# EAGLE design TeamDIGIT_Wired_PCB_QFN_V4 (EAGLE 9.6.2)
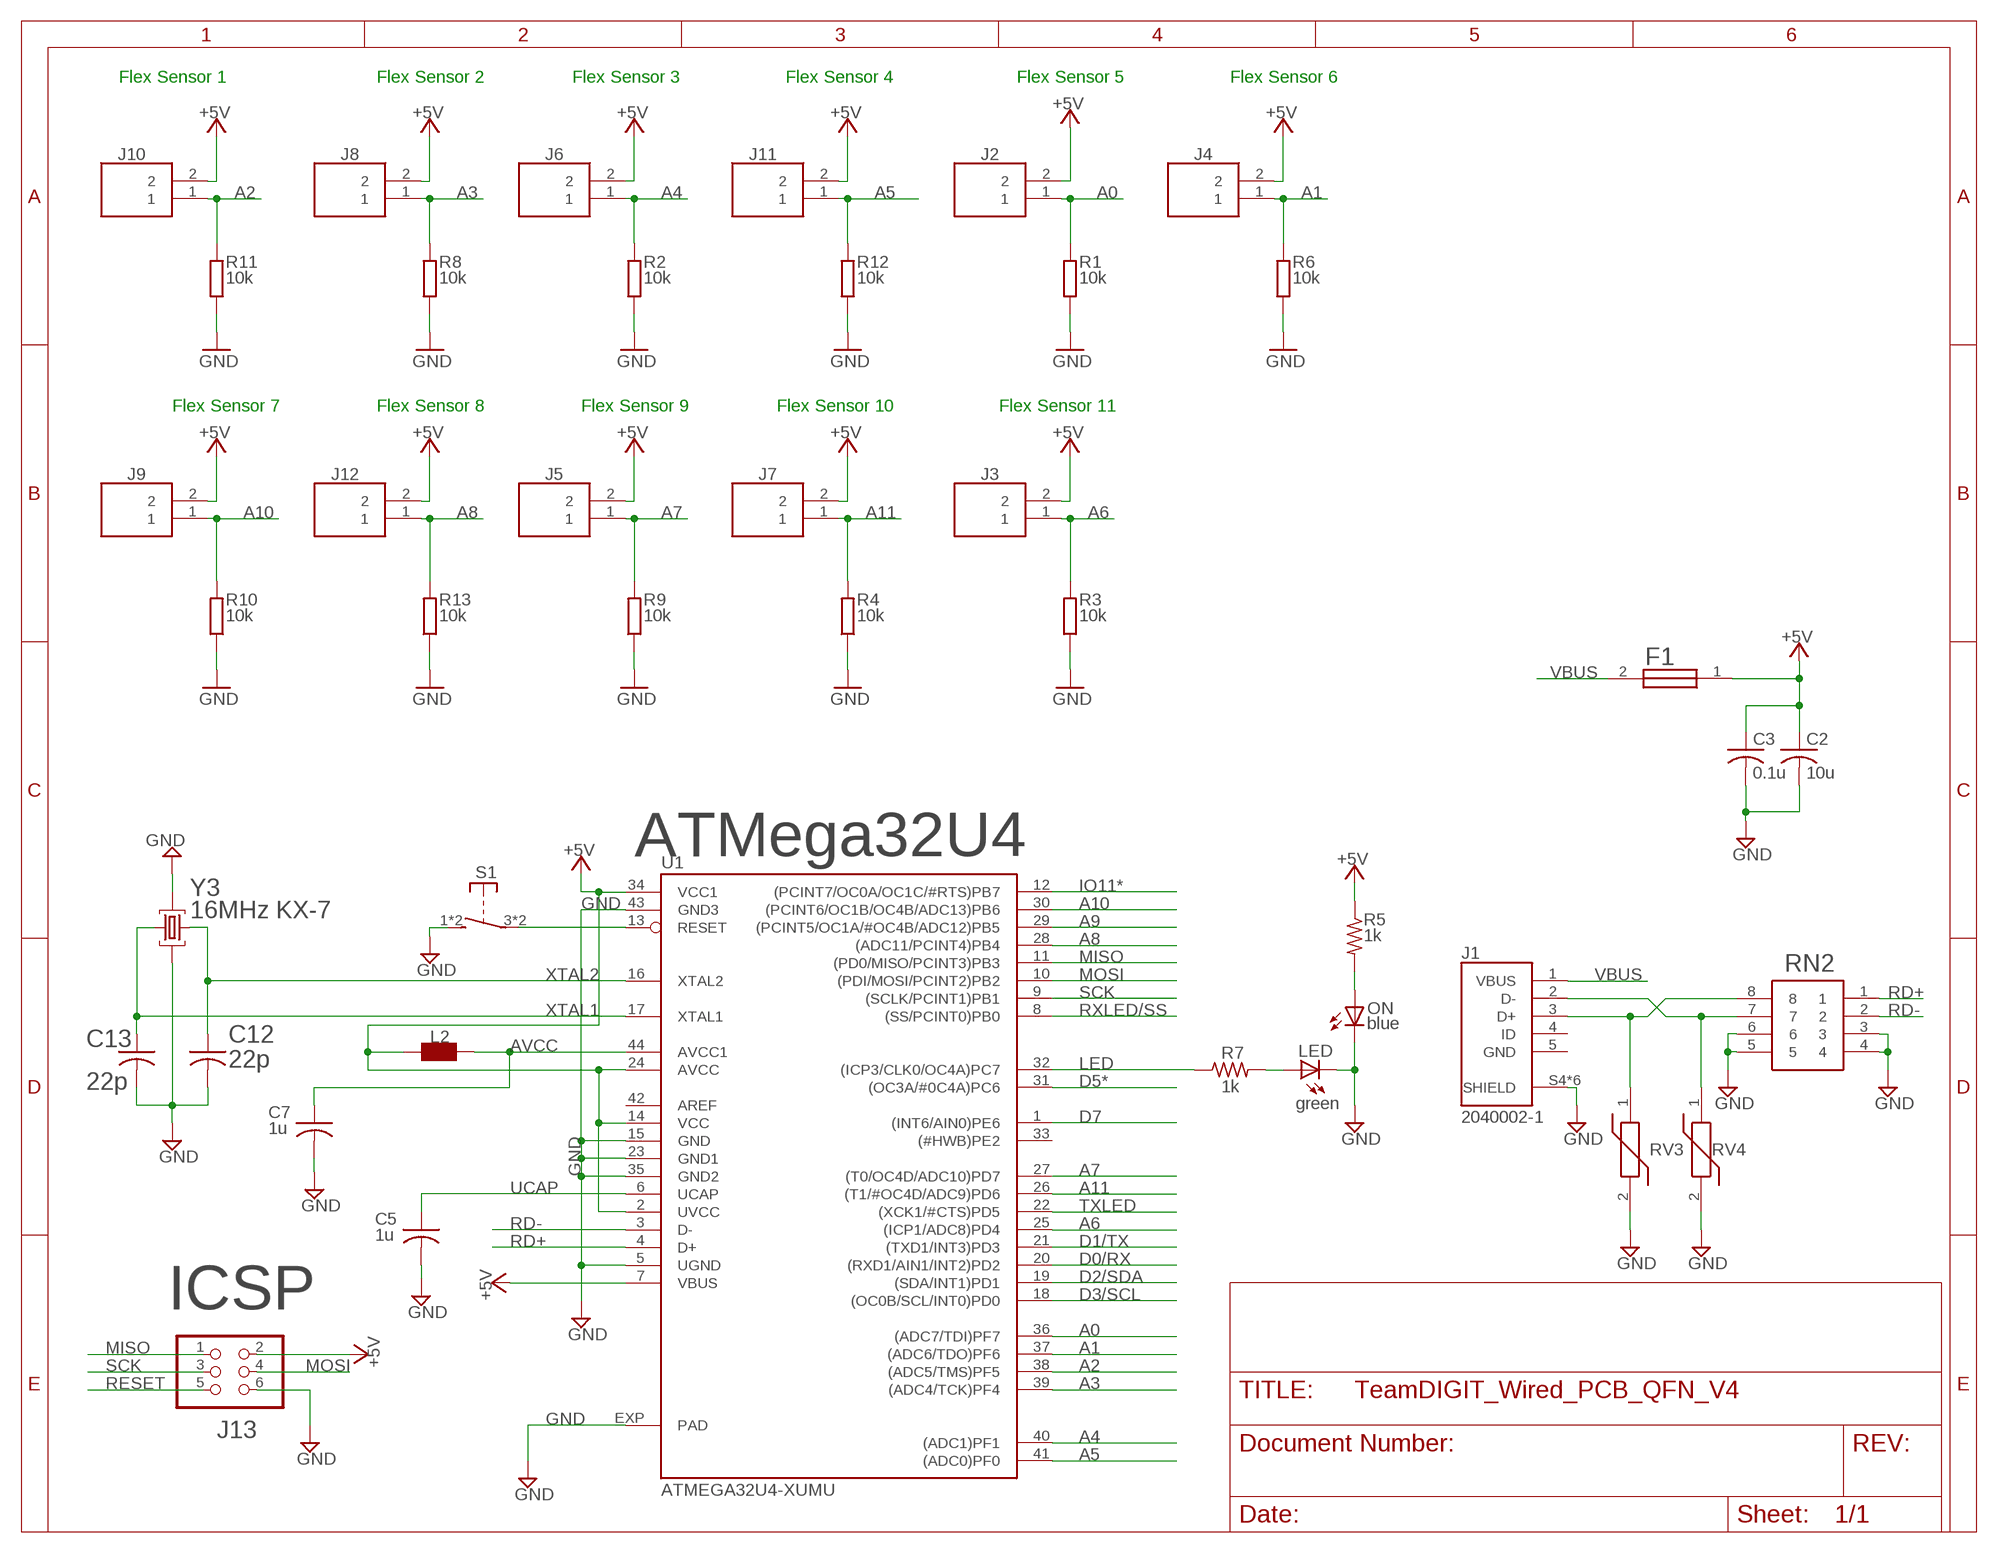
[diagram p0: schematic, sheet 1]

## Parts
C2  10u  C-USC0603  [C0603]
C3  0.1u  C-USC0603  [C0603]
C5  1u  C-USC0603  [C0603]
C7  1u  C-USC0603  [C0603]
C12  22p  C-USC0603  [C0603]
C13  22p  C-USC0603  [C0603]
F1  MF-MSMF050-2  [FUSC4632X85N]
J1  2040002-1  [TE_2040002-1]
J2  6-440054-2  [RHDR2W97P0X254_1X2_654X508X137]
J3  6-440054-2  [RHDR2W97P0X254_1X2_654X508X137]
J4  6-440054-2  [RHDR2W97P0X254_1X2_654X508X137]
J5  6-440054-2  [RHDR2W97P0X254_1X2_654X508X137]
J6  6-440054-2  [RHDR2W97P0X254_1X2_654X508X137]
J7  6-440054-2  [RHDR2W97P0X254_1X2_654X508X137]
J8  6-440054-2  [RHDR2W97P0X254_1X2_654X508X137]
J9  6-440054-2  [RHDR2W97P0X254_1X2_654X508X137]
J10  6-440054-2  [RHDR2W97P0X254_1X2_654X508X137]
J11  6-440054-2  [RHDR2W97P0X254_1X2_654X508X137]
J12  6-440054-2  [RHDR2W97P0X254_1X2_654X508X137]
J13  3x2M  PINHD-2X3  [2X03]
L2  MH2029-300Y  WE-CBF_0805  [0805]
LED  green  LEDCHIPLED_0805  [CHIPLED_0805]
ON  blue  LEDCHIPLED_0805  [CHIPLED_0805]
R1  10k  R-EU_R0603  [R0603]
R2  10k  R-EU_R0603  [R0603]
R3  10k  R-EU_R0603  [R0603]
R4  10k  R-EU_R0603  [R0603]
R5  1k  R-US_R0603  [R0603]
R6  10k  R-EU_R0603  [R0603]
R7  1k  R-US_R0603  [R0603]
R8  10k  R-EU_R0603  [R0603]
R9  10k  R-EU_R0603  [R0603]
R10  10k  R-EU_R0603  [R0603]
R11  10k  R-EU_R0603  [R0603]
R12  10k  R-EU_R0603  [R0603]
R13  10k  R-EU_R0603  [R0603]
RN2  CAY16-220J4LF  [CAY1647R0F4LF]
RV3  CG0603MLC-05E  [VARC1608X55N]
RV4  CG0603MLC-05E  [VARC1608X55N]
S1  434123025826  [434123025826]
U1  ATMEGA32U4-XUMU  [QFN44ML7X7]
Y3  16MHz KX-7  CRYSTAL-3.2-2.5  [CRYSTAL-3.2-2.5]

## Nets
+5V [5V]: C2.1 C3.1 F1.1 J2.2 J3.2 J4.2 J5.2 J6.2 J7.2 J8.2 J9.2 J10.2 J11.2 J12.2 J13.2 L2.1 R5.1 U1.2(UVCC) U1.7(VBUS) U1.14(VCC) U1.24(AVCC) U1.34(VCC1)
A0: J2.1 R1.2 U1.36((ADC7/TDI)PF7)
A1: J4.1 R6.2 U1.37((ADC6/TDO)PF6)
A2: J10.1 R11.2 U1.38((ADC5/TMS)PF5)
A3: J8.1 R8.2 U1.39((ADC4/TCK)PF4)
A4: J6.1 R2.2 U1.40((ADC1)PF1)
A5: J11.1 R12.2 U1.41((ADC0)PF0)
A6: J3.1 R3.2 U1.25((ICP1/ADC8)PD4)
A7: J5.1 R9.2 U1.27((T0/OC4D/ADC10)PD7)
A8: J12.1 R13.2 U1.28((ADC11/PCINT4)PB4)
A9: U1.29((PCINT5/OC1A/#OC4B/ADC12)PB5)
A10: J9.1 R10.2 U1.30((PCINT6/OC1B/OC4B/ADC13)PB6)
A11: J7.1 R4.2 U1.26((T1/#OC4D/ADC9)PD6)
AVCC: C7.1 L2.2 U1.44(AVCC1)
D0/RX: U1.20((RXD1/AIN1/INT2)PD2)
D1/TX: U1.21((TXD1/INT3)PD3)
D2/SDA: U1.19((SDA/INT1)PD1)
D3/SCL: U1.18((OC0B/SCL/INT0)PD0)
D5*: U1.31((OC3A/#0C4A)PC6)
D7: U1.1((INT6/AIN0)PE6)
D+: J1.3(D+) RN2.8 RV3.1
D-: J1.2(D-) RN2.7 RV4.1
GND [gnd]: C2.2 C3.2 C5.2 C7.2 C12.2 C13.2 J1.S4(SHIELD) J1.S5(SHIELD) J1.SH1(SHIELD) J1.SH2(SHIELD) J1.SH3(SHIELD) J1.SH4(SHIELD) J13.6 LED.C ON.C R1.1 R2.1 R3.1 R4.1 R6.1 R8.1 R9.1 R10.1 R11.1 R12.1 R13.1 RN2.3 RN2.4 RN2.5 RN2.6 RV3.2 RV4.2 S1.1(S) S1.2(S) U1.5(UGND) U1.15(GND) U1.23(GND1) U1.35(GND2) U1.43(GND3) U1.EXP(PAD) Y3.2(GND) Y3.4(GND)
IO11*: U1.12((PCINT7/OC0A/OC1C/#RTS)PB7)
LED: R7.1 U1.32((ICP3/CLK0/OC4A)PC7)
MISO: J13.1 U1.11((PD0/MISO/PCINT3)PB3)
MOSI: J13.4 U1.10((PDI/MOSI/PCINT2)PB2)
N$3: ON.A R5.2
N$7: LED.A R7.2
RD+: RN2.1 U1.4(D+)
RD-: RN2.2 U1.3(D-)
RESET: J13.5 S1.3(P) S1.4(P) U1.13(RESET)
RXLED/SS: U1.8((SS/PCINT0)PB0)
SCK: J13.3 U1.9((SCLK/PCINT1)PB1)
TXLED: U1.22((XCK1/#CTS)PD5)
UCAP: C5.1 U1.6(UCAP)
VBUS: F1.2 J1.1(VBUS)
XTAL1: C13.1 U1.17(XTAL1) Y3.1(C1)
XTAL2: C12.1 U1.16(XTAL2) Y3.3(C2)
Unconnected: J1.4(ID) U1.33((#HWB)PE2)

## Notes on the sheet
- Flex Sensor 1 | Flex Sensor 2 | Flex Sensor 3 | Flex Sensor 4 | Flex Sensor 5 | Flex Sensor 6
- Flex Sensor 7 | Flex Sensor 8 | Flex Sensor 9 | Flex Sensor 10 | Flex Sensor 11
- ATMega32U4
- ICSP

## Power pins joined to a net without a drawn wire
AREF: U1.42(AREF)
GND: J1.5(GND)

## Library data of the parts
C2 C3 C5 C7 C12 C13 = rcl:C-US: CAPACITOR, American symbol; SPICEPREFIX: C
F1 = SamacSys_Parts:MF-MSMF050-2: Fuse, PTC, Resettable, SMD, 1812, 500mA Bourns 0.5A Surface Mount Resettable Fuse, 15 V Source: Datasheet <https://www.bourns.com/pdfs/mfmsmf.pdf>; DESCRIPTION: Fuse, PTC, Resettable, SMD, 1812, 500mA Bourns 0.5A Surface Mount Resettable Fuse, 15 V; HEIGHT: 0.85mm; MANUFACTURER_NAME: Bourns; MANUFACTURER_PART_NUMBER: MF-MSMF050-2; MOUSER_PART_NUMBER: 652-MF-MSMF050-2; MOUSER_PRICE-STOCK: https://www.mouser.co.uk/ProductDetail/Bourns/MF-MSMF050-2?qs=t3shhpq1i1DZ7OBD5kLNoA%3D%3D
J1 = 2040002-1:2040002-1: Conn USB Type B RCP 5 POS 0.65mm Solder RA SMD 5 Terminal 1 Port T/R; CENTERLINE_PITCH: .65 mm[.025 in]; COMMENT: 2040002-1; DESCRIPTION: Conn Micro USB 2.0 Type B RCP 5 POS 0.65mm Solder RA SMD 5 Terminal 1 Port T/R; DIGI-KEY_PART_NUMBER: A108263TR-ND; MF: TE Connectivity; MP: 2040002-1; NUMBER_OF_POSITIONS: 5; PACKAGE: None; PRODUCT_TYPE: Connector; PURCHASE-URL: https://pricing.snapeda.com/search/part/2040002-1/?ref=eda
J2-J12 = SamacSys_Parts:6-440054-2: HPI 2.0MM,HDR,2POSVERTICAL,BLK Source: Datasheet <https://www.te.com/commerce/DocumentDelivery/DDEController?Action=srchrtrv&DocNm=1-1773713-2_HPI_QRG_EN&DocType=Data Sheet&DocLang=English&PartCntxt=6-440054-2&DocFormat=pdf>; DESCRIPTION: HPI 2.0MM,HDR,2POSVERTICAL,BLK; HEIGHT: 13.79mm; MANUFACTURER_NAME: TE Connectivity; MANUFACTURER_PART_NUMBER: 6-440054-2; MOUSER_PART_NUMBER: 571-6-440054-2; MOUSER_PRICE-STOCK: https://www.mouser.co.uk/ProductDetail/TE-Connectivity-AMP/6-440054-2?qs=lA4hlRvK5kBpenPnFCArVg%3D%3D
J13 = gen_comp:PINHD-2X3: PIN HEADER
L2 = wuerth-elektronik:WE-CBF: SMD EMI Suppression Ferrite Beads - excellent anti-EMI properties - low DCR - impedances till 3000 ohms - rated current up to 6 A
LED ON = led:LED: LED OSRAM: - CHIPLED LG R971, LG N971, LY N971, LG Q971, LY Q971, LO R971, LY R971 LH N974, LH R974 LS Q976, LO Q976, LY Q976 LO Q996 - Hyper CHIPLED LW Q18S LB Q993, LB Q99A, LB R99A - SideLED LS A670, LO A670, LY A670, LG A670, LP A670 LB A673, LV A673, LT A673, LW A673 LH A674 LY A675 LS A676, LA A676, LO A676, LY A676, LW A676 LS A679, LY A679, LG A679 - Hyper Micro SIDELED® LS Y876, LA Y876, LO Y876, LY Y876 LT Y87S - SmartLED LW L88C, LW L88S LB L89C, LB L89S, LG L890 LS L89K, LO L89K, LY L89K LS L896, LA L896, LO L896, LY L896 - TOPLED LS T670, LO T670, LY T670, LG T670, LP T670 LSG T670, LSP T670, LSY T670, LOP T670, LYG T670 LG T671, LOG T671, LSG T671 LB T673, LV T673, LT T673, LW T673 LH T674 LS T676, LA T676, LO T676, LY T676, LB T676, LH T676, LSB T676, LW T676 LB T67C, LV T67C, LT T67C, LS T67K, LO T67K, LY T67K, LW E67C LS E67B, LA E67B, LO E67B, LY E67B, LB E67C, LV E67C, LT E67C LW T67C LS T679, LY T679, LG T679 LS T770, LO T770, LY T770, LG T770, LP T770 LB T773, LV T773, LT T773, LW T773 LH T774 LS E675, LA E675, LY E675, LS T675 LS T776, LA T776, LO T776, LY T776, LB T776 LHGB T686 LT T68C, LB T68C - Hyper Mini TOPLED® LB M676 - Mini TOPLED Santana® LG M470 LS M47K, LO M47K, LY M47K Source: http://www.osram.convergy.de LUXEON: - LUMILED® LXK2-PW12-R00, LXK2-PW12-S00, LXK2-PW14-U00, LXK2-PW14-V00 LXK2-PM12-R00, LXK2-PM12-S00, LXK2-PM14-U00 LXK2-PE12-Q00, LXK2-PE12-R00, LXK2-PE12-S00, LXK2-PE14-T00, LXK2-PE14-U00 LXK2-PB12-K00, LXK2-PB12-L00, LXK2-PB12-M00, LXK2-PB14-N00, LXK2-PB14-P00, LXK2-PB14-Q00 LXK2-PR12-L00, LXK2-PR12-M00, LXK2-PR14-Q00, LXK2-PR14-R00 LXK2-PD12-Q00, LXK2-PD12-R00, LXK2-PD12-S00 LXK2-PH12-R00, LXK2-PH12-S00 LXK2-PL12-P00, LXK2-PL12-Q00, LXK2-PL12-R00 Source: www.luxeon.com KINGBRIGHT: KA-3528ASYC Source: www.kingbright.com
R1-R4 R6 R8-R13 = rcl:R-EU_: RESISTOR, European symbol; SPICEPREFIX: R
R5 R7 = rcl:R-US_: RESISTOR, American symbol; SPICEPREFIX: R
RN2 = SamacSys_Parts:CAY16-220J4LF: Bourns CAY16 Series 22 +/-5% Isolated SMT Resistor Array, 4 Resistors, 0.25W total 1206 (3216M) package Convex Source: Datasheet <https://www.bourns.com/docs/Product-Datasheets/CATCAY.pdf>; DESCRIPTION: Bourns CAY16 Series 22 +/-5% Isolated SMT Resistor Array, 4 Resistors, 0.25W total 1206 (3216M) package Convex; HEIGHT: 0.6mm; MANUFACTURER_NAME: Bourns; MANUFACTURER_PART_NUMBER: CAY16-220J4LF; MOUSER_PART_NUMBER: 652-CAY16-220J4LF; MOUSER_PRICE-STOCK: https://www.mouser.co.uk/ProductDetail/Bourns/CAY16-220J4LF?qs=GbiU%252BivmtKA3DUxfEznDpA%3D%3D
RV3 RV4 = SamacSys_Parts:CG0603MLC-05E: Varistor, ESD Protector, 5VDC,20V,0603 Bourns MLC Series Power Varistor 0.5pF 20V 0603 Case Source: Datasheet; DESCRIPTION: Varistor, ESD Protector, 5VDC,20V,0603 Bourns MLC Series Power Varistor 0.5pF 20V 0603 Case; HEIGHT: 0.55mm; MANUFACTURER_NAME: Bourns; MANUFACTURER_PART_NUMBER: CG0603MLC-05E; MOUSER_PART_NUMBER: 652-CG0603MLC-05E; MOUSER_PRICE-STOCK: https://www.mouser.co.uk/ProductDetail/Bourns/CG0603MLC-05E?qs=lDok7oSghXVLNKMK69q%252BFQ%3D%3D
S1 = SamacSys_Parts:434123025826: TACT SWITCH 4.2X3.2MM VERTICAL T Source: Datasheet <https://www.we-online.com/catalog/datasheet/434123025826.pdf>; DESCRIPTION: TACT SWITCH 4.2X3.2MM VERTICAL T; HEIGHT: 2.7mm; MANUFACTURER_NAME: Wurth Elektronik; MANUFACTURER_PART_NUMBER: 434123025826; MOUSER_PART_NUMBER: 710-434123025826; MOUSER_PRICE-STOCK: https://www.mouser.co.uk/ProductDetail/Wurth-Elektronik/434123025826?qs=sPbYRqrBIVmyWmz4suwZ4A%3D%3D
U1 = gen_comp:ATMEGA32U4-XU
Y3 = gen_comp:CRYSTAL-3.2-2.5

## Net classes
0 default: width 0.254 mm, drill 0.127 mm
1 5V: width 0.254 mm, drill 0.254 mm
2 gnd: width 0.254 mm
3 usbvcc: width 0.254 mm
4 aref: width 0.305 mm

## Board
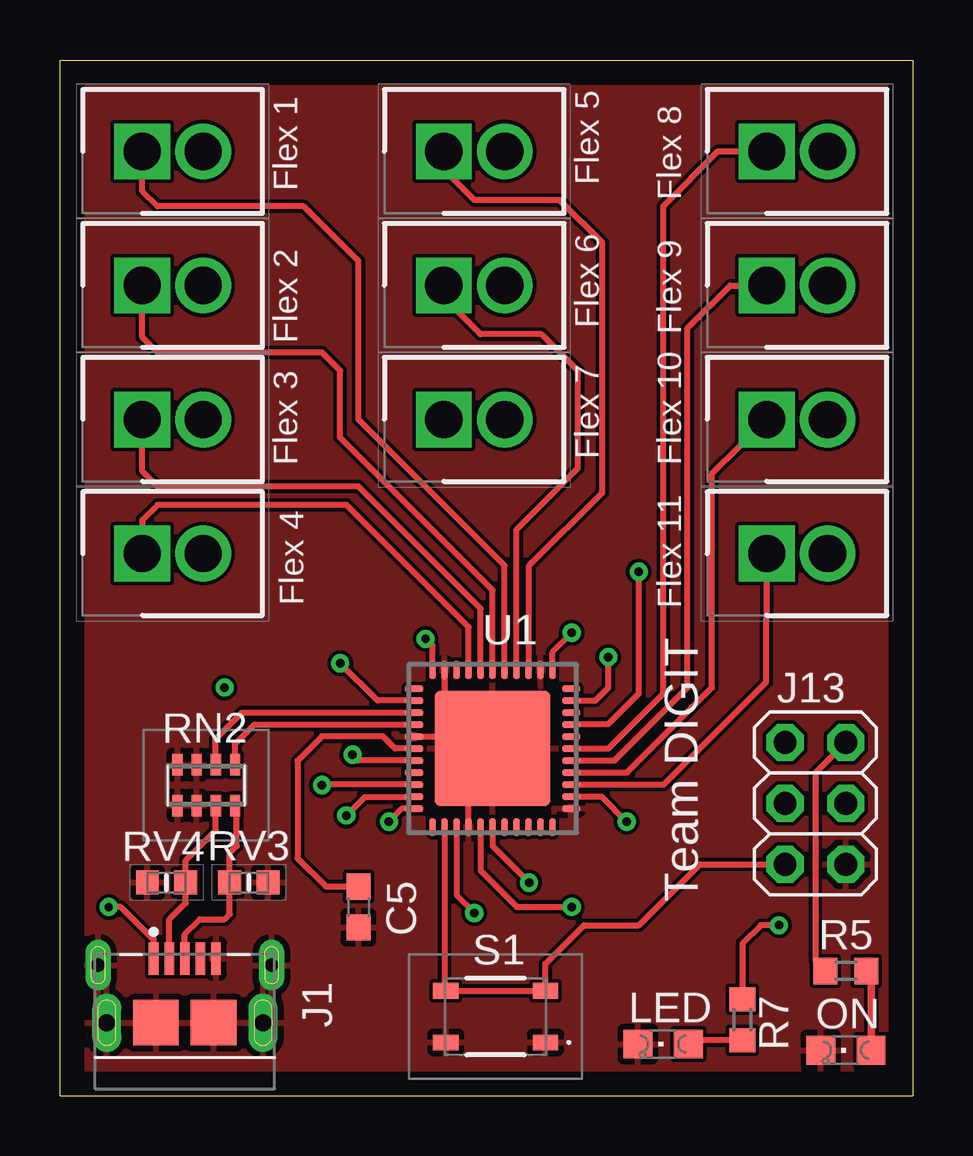
[diagram p1: board, top side]
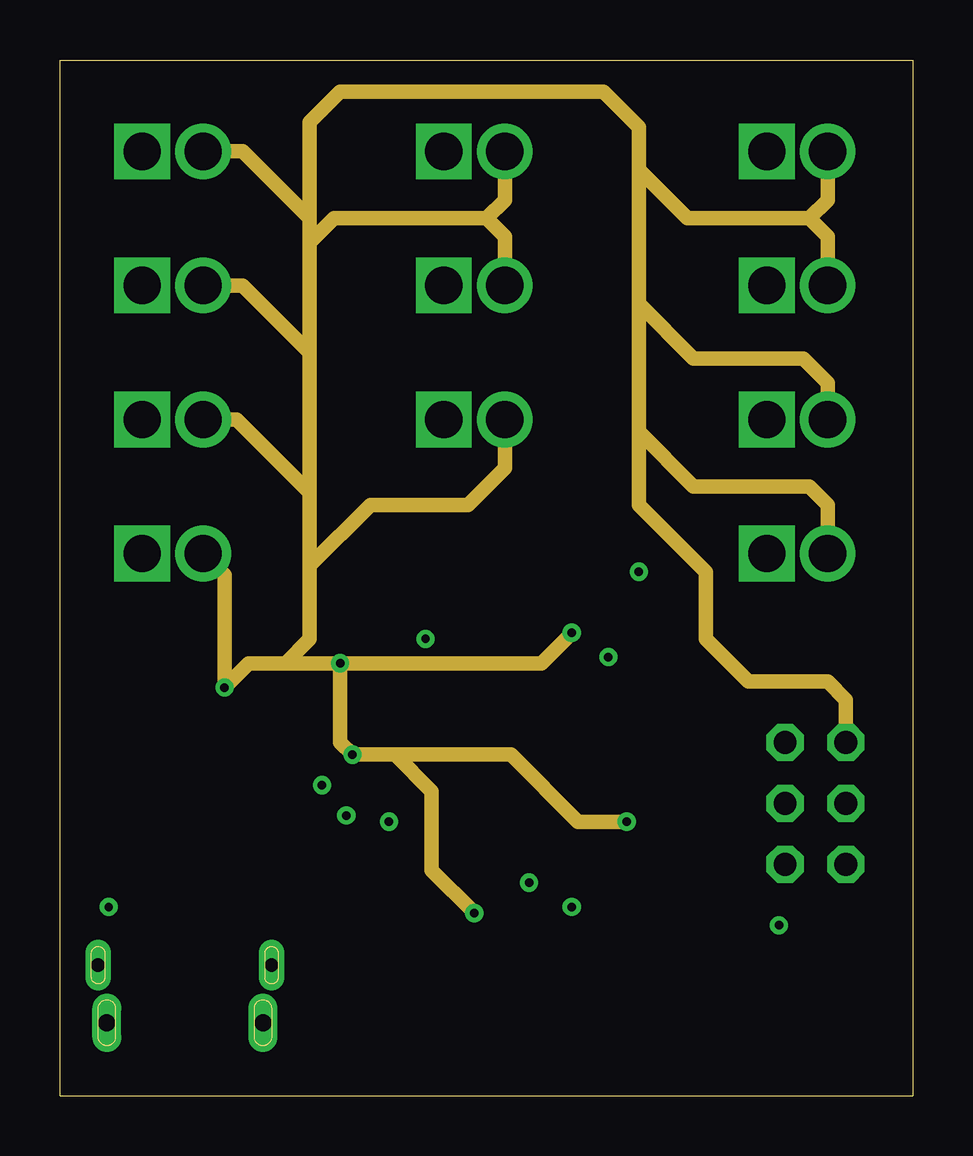
[diagram p2: board, inner layer Route2]
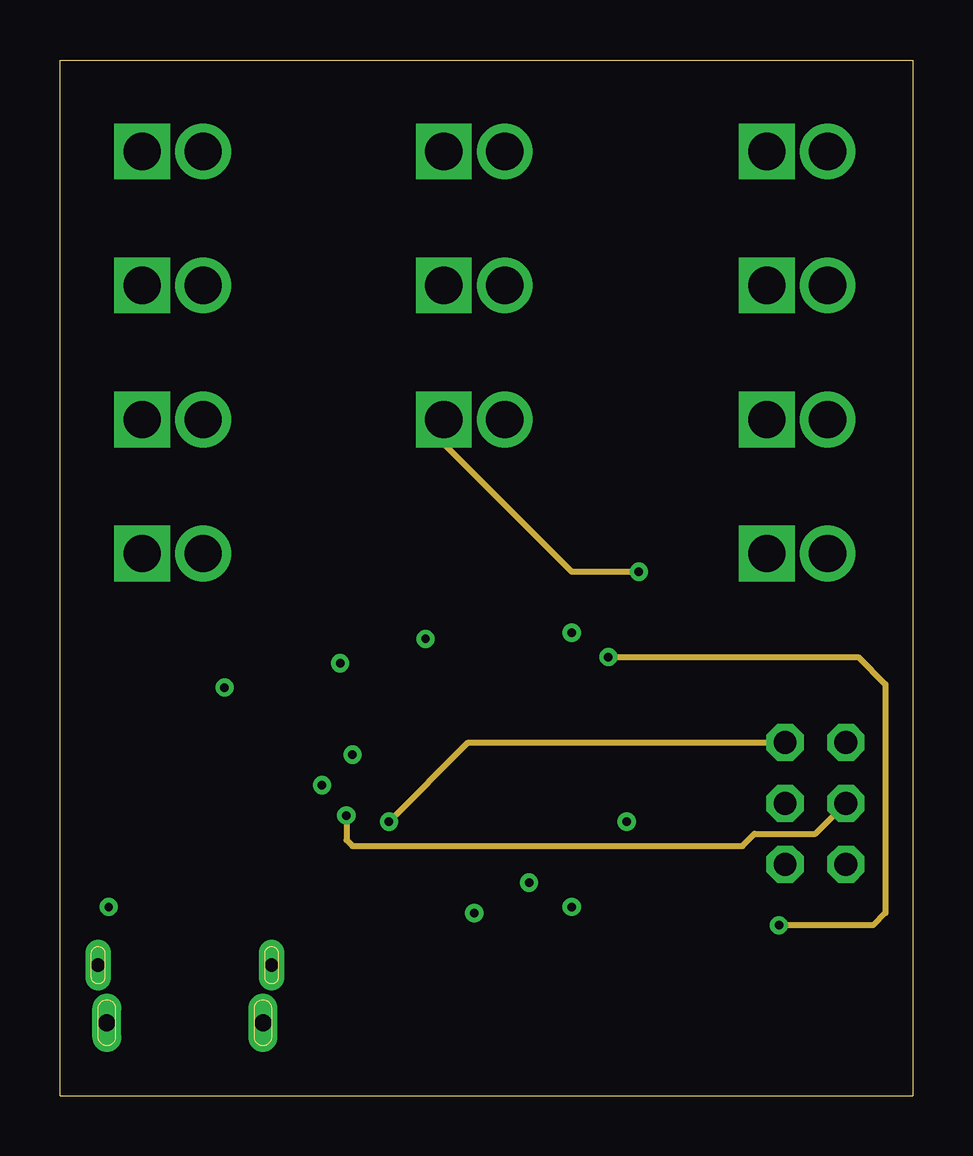
[diagram p3: board, inner layer Route15]
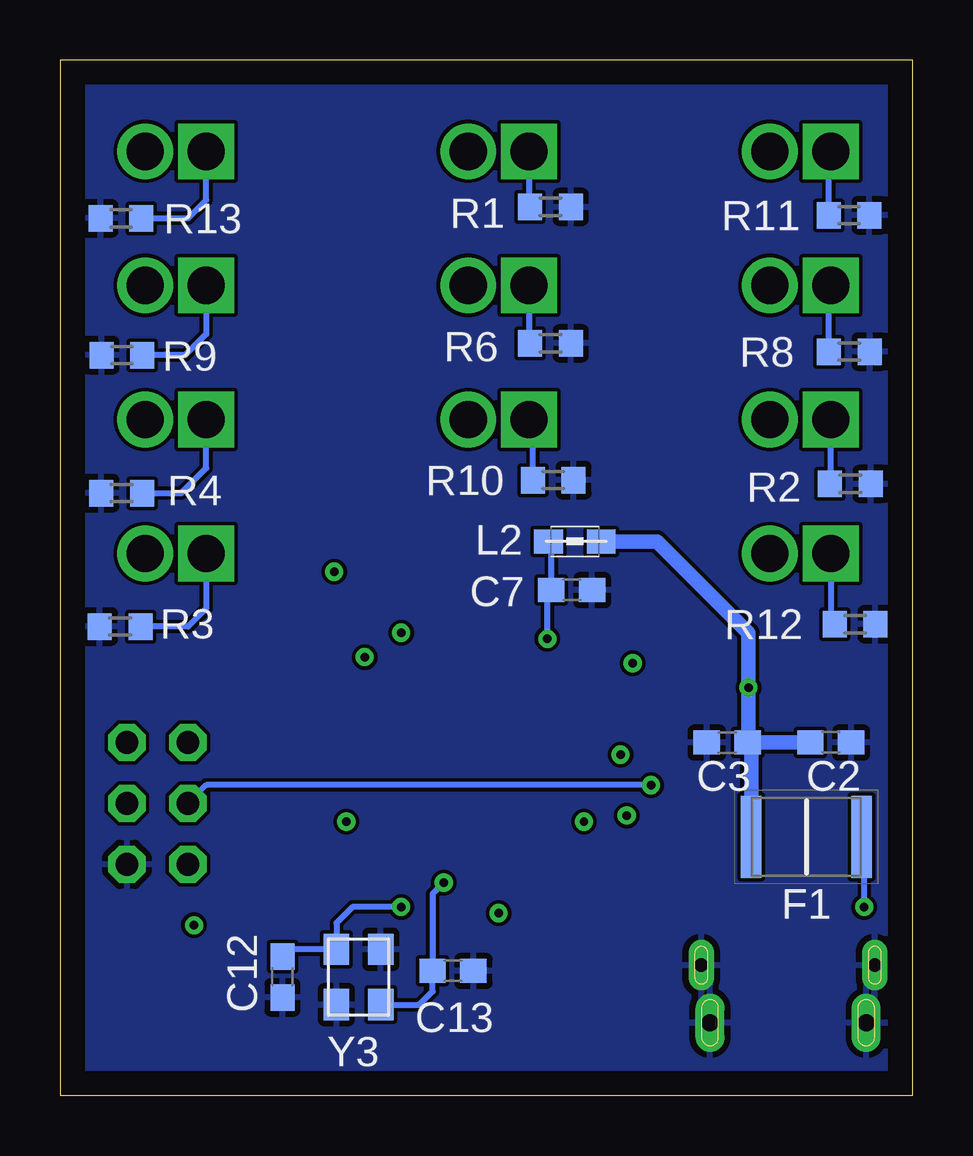
[diagram p4: board, bottom side, seen from below]

Size 35.56 x 43.18 mm. Coordinates in mm from the lower left corner, seen from the top.
Outline: 0,0 0,43.18 35.56,43.18 35.56,0 0,0
Copper layers (1+2*15+16): Top 0.035mm / dielectric 1.5mm / Route2 0.035mm / dielectric 0.15mm / Route15 0.035mm / dielectric 0.2mm / Bottom 0.035mm
Design rules "default *": minimum track width 6mil, minimum drill 0.35mm, track to track 6mil, track to pad 6mil, pad to pad 6mil, via to via 6mil, smd to smd 6mil, copper to edge 40mil, drill to drill 6mil, minimum pad ring 10mil, minimum via ring 8mil, stop-mask expansion 4mil, vias tented up to drill 0mil, thermal gap 10mil

### Footprints (pad centres in the part's own frame; a part is rotated, then mirrored left to right if it is on the bottom)
C0603 = smd 1.1 x 1: 1 -0.85,0; 2 0.85,0
FUSC4632X85N = smd 0.85 x 3.43: 1 -2.3,0; 2 2.3,0
TE_2040002-1 = smd 0.4 x 1.35: 1 -1.3,2.675; 2 -0.65,2.675; 3 0,2.675; 4 0.65,2.675; 5 1.3,2.675 | smd 1.9 x 1.9: S4 -1.2,0; S5 1.2,0 | drill 0.56 long: SH1 -3.615,2.4; SH2 3.615,2.4 | drill 0.71 long: SH3 3.255,0; SH4 -3.255,0
RHDR2W97P0X254_1X2_654X508X137 = drill 1.55 pad 2.325 square: 1 0,0 | drill 1.55 pad 2.325: 2 2.54,0
2X03 = drill 0.95 pad 1.55 octagon: 1 -2.54,-1.27; 2 -2.54,1.27; 3 0,-1.27; 4 0,1.27; 5 2.54,-1.27; 6 2.54,1.27
0805 = smd 1.2 x 1: 1 -1.1,0; 2 1.1,0
CHIPLED_0805 = smd 1.2 x 1.2: A 0,-1.05; C 0,1.05
R0603 = smd 1 x 1.1: 1 -0.85,0; 2 0.85,0
CAY1647R0F4LF = smd 0.425 x 0.9: 1 -1.2,-0.85; 2 -0.4,-0.85; 3 0.4,-0.85; 4 1.2,-0.85; 5 1.2,0.85; 6 0.4,0.85; 7 -0.4,0.85; 8 -1.2,0.85
VARC1608X55N = smd 0.95 x 1: 1 -0.8,0; 2 0.8,0
434123025826 = smd 1.05 x 0.65: 1 -2.075,1.075; 2 2.075,1.075; 3 -2.075,-1.075; 4 2.075,-1.075
QFN44ML7X7 = smd 0.75 x 0.275: 1 -3.275,2.5; 2 -3.275,2; 3 -3.275,1.5; 4 -3.275,1; 5 -3.275,0.5; 6 -3.275,0; 7 -3.275,-0.5; 8 -3.275,-1; 9 -3.275,-1.5; 10 -3.275,-2; 11 -3.275,-2.5; 23 3.275,-2.5; 24 3.275,-2; 25 3.275,-1.5; 26 3.275,-1; 27 3.275,-0.5; 28 3.275,0; 29 3.275,0.5; 30 3.275,1; 31 3.275,1.5; 32 3.275,2; 33 3.275,2.5 | smd 0.275 x 0.75: 12 -2.5,-3.275; 13 -2,-3.275; 14 -1.5,-3.275; 15 -1,-3.275; 16 -0.5,-3.275; 17 0,-3.275; 18 0.5,-3.275; 19 1,-3.275; 20 1.5,-3.275; 21 2,-3.275; 22 2.5,-3.275; 34 2.5,3.275; 35 2,3.275; 36 1.5,3.275; 37 1,3.275; 38 0.5,3.275; 39 0,3.275; 40 -0.5,3.275; 41 -1,3.275; 42 -1.5,3.275; 43 -2,3.275; 44 -2.5,3.275 | smd 4.826 x 4.826: EXP 0,0
CRYSTAL-3.2-2.5 = smd 1.3 x 1.05: 1 -1.15,-0.925; 2 1.15,-0.925; 3 1.15,0.925; 4 -1.15,0.925

### Placement (x,y rotation side)
C2  3.43,14.73 0 bottom
C3  7.75,14.73 180 bottom
C5  12.45,7.87 270 top
C7  14.22,21.08 0 bottom
C12  26.29,4.95 270 bottom
C13  19.18,5.21 0 bottom
F1  4.45,10.79 0 bottom
J1  5.21,3.05 0 top
J2  16,39.37 0 top
J3  29.46,22.61 0 top
J4  16,33.78 0 top
J5  29.46,33.78 0 top
J6  3.43,28.19 0 top
J7  29.46,28.19 0 top
J8  3.43,33.78 0 top
J9  16,28.19 0 top
J10  3.43,39.37 0 top
J11  3.43,22.61 0 top
J12  29.46,39.37 0 top
J13  31.5,12.19 270 top
L2  14.1,23.11 180 bottom
LED  25.15,2.16 90 top
ON  32.77,1.91 90 top
R1  15.11,37.05 180 bottom
R2  2.61,25.51 180 bottom
R3  33.05,19.56 0 bottom
R4  32.99,25.12 0 bottom
R5  32.77,5.21 0 top
R6  15.11,31.37 180 bottom
R7  28.45,3.17 270 top
R8  2.66,31.02 180 bottom
R9  32.98,30.87 0 bottom
R10  15,25.67 180 bottom
R11  2.67,36.7 180 bottom
R12  2.41,19.66 180 bottom
R13  33.02,36.58 0 bottom
RN2  6.1,12.95 180 top
RV3  7.87,8.89 0 top
RV4  4.45,8.89 180 top
S1  18.16,3.3 180 top
U1  18.03,14.48 0 top
Y3  23.11,4.95 90 bottom

### Tracks (layer width: path | path; a pad name or v marks a point on that pad's centre or on a via)
+5V  (via drill 0.35)
  Top 0.254: J13.2 31.5,13.46 31.5,5.63 R5.1 | U1.2 13.24,16.48 v11.68,18.03 | U1.7 12.44,13.98 v12.19,14.22 | U1.14 16.53,8.36 v17.27,7.62 | U1.34 20.53,18.5 v21.34,19.3 | U1.24 22.57,12.48 v23.62,11.43
  Route2 0.61: 9.4,18.03 7.87,18.03 v6.86,17.02 6.86,21.72 J11.2 | 9.4,18.03 10.41,19.05 10.41,22.1 | 24.13,38.61 24.13,40.39 22.66,41.85 11.68,41.85 10.41,40.58 10.41,36.58 | 24.13,38.61 24.13,33.02 | 24.13,33.02 24.13,27.69 | 10.41,22.1 10.41,25.15 | 10.41,30.99 10.41,35.56 | 10.41,35.56 10.41,36.58 | 10.41,30.99 10.41,25.15 | 10.41,25.15 7.37,28.19 J6.2 | 10.41,22.1 12.95,24.64 17.02,24.64 18.54,26.16 J9.2 | 10.41,30.99 7.62,33.78 J8.2 | 24.13,38.61 26.16,36.58 31.24,36.58 | 24.13,33.02 26.42,30.73 30.99,30.73 32,29.72 J7.2 | 24.13,27.69 26.42,25.4 31.24,25.4 32,24.64 J3.2 | J13.2 32.77,16.51 32,17.27 28.7,17.27 26.92,19.05 26.92,21.84 24.13,24.64 24.13,27.69 | v11.68,18.03 9.4,18.03 | v11.68,18.03 11.68,14.73 v12.19,14.22 13.97,14.22 | v17.27,7.62 15.49,9.4 15.49,12.7 13.97,14.22 | v21.34,19.3 20.07,18.03 v11.68,18.03 | v23.62,11.43 21.59,11.43 18.8,14.22 13.97,14.22 | J10.2 7.62,39.37 10.41,36.58 | J2.2 18.54,37.34 17.78,36.58 | 10.41,35.56 11.43,36.58 17.78,36.58 | 17.78,36.58 18.54,35.81 J4.2 | 31.24,36.58 32,35.81 J5.2 | 31.24,36.58 32,37.34 J12.2
  Bottom 0.61: F1.1 6.75,14.58 C3.1 | C3.1 C2.1 | C3.1 6.86,14.77 v6.86,17.02 6.86,19.3 10.67,23.11 L2.1
A0
  Top 0.254: U1.36 19.56,17.78 19.56,22.1 22.61,25.15 22.61,35.56 20.83,37.34 17.27,37.34 16,38.61 J2.1
  Bottom 0.254: J2.1 16,37.1 R1.2
A1
  Top 0.254: U1.37 19.03,23.61 21.59,26.16 21.59,30.23 20.07,31.75 17.53,31.75 16,33.27 J4.1
  Bottom 0.254: J4.1 16,31.41 R6.2
A2
  Top 0.254: U1.38 18.53,22.11 12.45,28.19 12.45,34.8 10.16,37.08 4.06,37.08 3.43,37.72 J10.1
  Bottom 0.254: R11.2 3.52,39.28 J10.1
A3
  Top 0.254: U1.39 18.03,21.08 11.68,27.43 11.68,30.23 10.92,30.99 4.06,30.99 3.43,31.62 J8.1
  Bottom 0.254: R8.2 3.51,33.7 J8.1
A4
  Top 0.254: U1.40 17.53,20.31 12.45,25.4 4.06,25.4 3.43,26.04 J6.1
  Bottom 0.254: R2.2 3.43,25.55 J6.1
A5
  Top 0.254: U1.41 17.03,19.54 11.94,24.64 4.06,24.64 3.43,24 J11.1
  Bottom 0.254: J11.1 3.43,19.83 R12.2
A6
  Top 0.254: U1.25 25.17,12.98 29.44,17.25 J3.1
  Bottom 0.254: J3.1 29.46,22.48 29.46,20.32 30.23,19.56 R3.2
A7
  Top 0.254: U1.27 23.12,13.98 26.16,17.02 26.16,32 27.94,33.78 J5.1
  Bottom 0.254: J5.1 29.46,33.76 29.46,31.75 30.34,30.87 R9.2
A8
  Top 0.254: U1.28 22.86,14.48 25.15,16.76 25.15,37.08 27.43,39.37 J12.1
  Bottom 0.254: R13.2 30.23,36.58 29.46,37.34 J12.1
A10  (via drill 0.35)
  Top 0.254: U1.30 21.32,15.49 22.86,15.49 24.13,16.76 v24.13,21.84
  Route15 0.254: v24.13,21.84 21.34,21.84 16.05,27.13 J9.1
  Bottom 0.254: R10.2 15.85,28.04 J9.1
A11
  Top 0.254: U1.26 23.64,13.48 27.18,17.02 27.18,25.93 J7.1
  Bottom 0.254: R4.2 30.5,25.12 29.46,26.16 J7.1
AVCC  (via drill 0.35)
  Top 0.254: U1.44 15.53,18.76 v15.24,19.05
  Bottom 0.254: v15.24,19.05 15.24,20.92 C7.1 15.07,22.99 L2.2
D+
  Top 0.254: J1.3 5.21,6.73 5.84,7.37 6.86,7.37 7.07,7.58 RV3.1 7.07,10.12 7.37,10.41 7.37,12.03 RN2.8
D-
  Top 0.254: J1.2 4.56,7.35 5.25,8.04 RV4.1 5.25,9.82 6.5,11.07 RN2.7
GND
  Top 0.254: U1.15 17.03,13.48 U1.EXP | U1.5 17.53,14.98 U1.EXP | U1.43 16.03,16.48 U1.EXP
  pour Bottom: -1.27,-1.91 -1.27,43.81 36.96,43.81 36.96,-1.91
  pour Top: 38.23,-3.17 -2.54,-3.17 -2.54,45.09 38.23,45.09
LED  (via drill 0.35)
  Top 0.254: U1.32 22.32,16.48 22.86,17.02 v22.86,18.29 | v29.97,7.11 29.21,7.11 28.45,6.35 R7.1
  Route15 0.254: v22.86,18.29 33.27,18.29 34.41,17.15 34.41,7.62 33.9,7.11 v29.97,7.11
MISO  (via drill 0.35)
  Top 0.254: U1.11 14.26,11.98 v13.72,11.43
  Route15 0.254: v13.72,11.43 17.02,14.73 J13.1
MOSI  (via drill 0.35)
  Top 0.254: U1.10 14.73,12.45 12.7,12.45 v11.94,11.68
  Route15 0.254: J13.4 31.5,10.92 28.96,10.92 28.45,10.41 12.19,10.41 11.94,10.67 v11.94,11.68
N$3
  Top 0.305: ON.A 33.82,5.01 R5.2
N$7
  Top 0.254: R7.2 26.36,2.33 LED.A
RD+
  Top 0.254: RN2.1 7.3,14.66 8.11,15.48 U1.4
RD-
  Top 0.254: RN2.2 6.5,14.88 7.6,15.98 U1.3
RESET
  Top 0.254: U1.13 16.03,4.43 S1.4 S1.3 20.24,5.5 21.84,7.11 24.13,7.11 26.67,9.65 J13.5
SCK  (via drill 0.35)
  Top 0.254: U1.9 10.95,12.98 v10.92,12.95
  Bottom 0.254: v10.92,12.95 29.46,12.95 J13.3
UCAP
  Top 0.254: C5.1 11.09,8.72 9.91,9.91 9.91,13.97 10.92,14.99 13.46,14.99 13.97,14.48 U1.6
VBUS  (via drill 0.35)
  Top 0.254: J1.1 3.91,6.51 2.54,7.87 v2.03,7.87
  Bottom 0.254: v2.03,7.87 2.03,10.68 F1.2
XTAL1  (via drill 0.35)
  Top 0.254: U1.17 18.03,10.41 v19.56,8.89
  Bottom 0.254: Y3.1 20.58,3.8 20.03,4.36 C13.1 20.03,8.42 v19.56,8.89
XTAL2  (via drill 0.35)
  Top 0.254: U1.16 17.53,9.39 19.05,7.87 v21.34,7.87
  Bottom 0.254: C12.1 25.99,6.1 Y3.3 24.04,7.2 23.37,7.87 v21.34,7.87

### Text on the board
tNames: Flex 1 | Flex 5 | Flex 8 | Flex 6 | Flex 9 | Flex 2 | Flex 7 | Flex 3 | Flex 10 | Flex 4 | Flex 11 | Team DIGIT